# Altium schematic sheet Main2.SchDoc
size A4
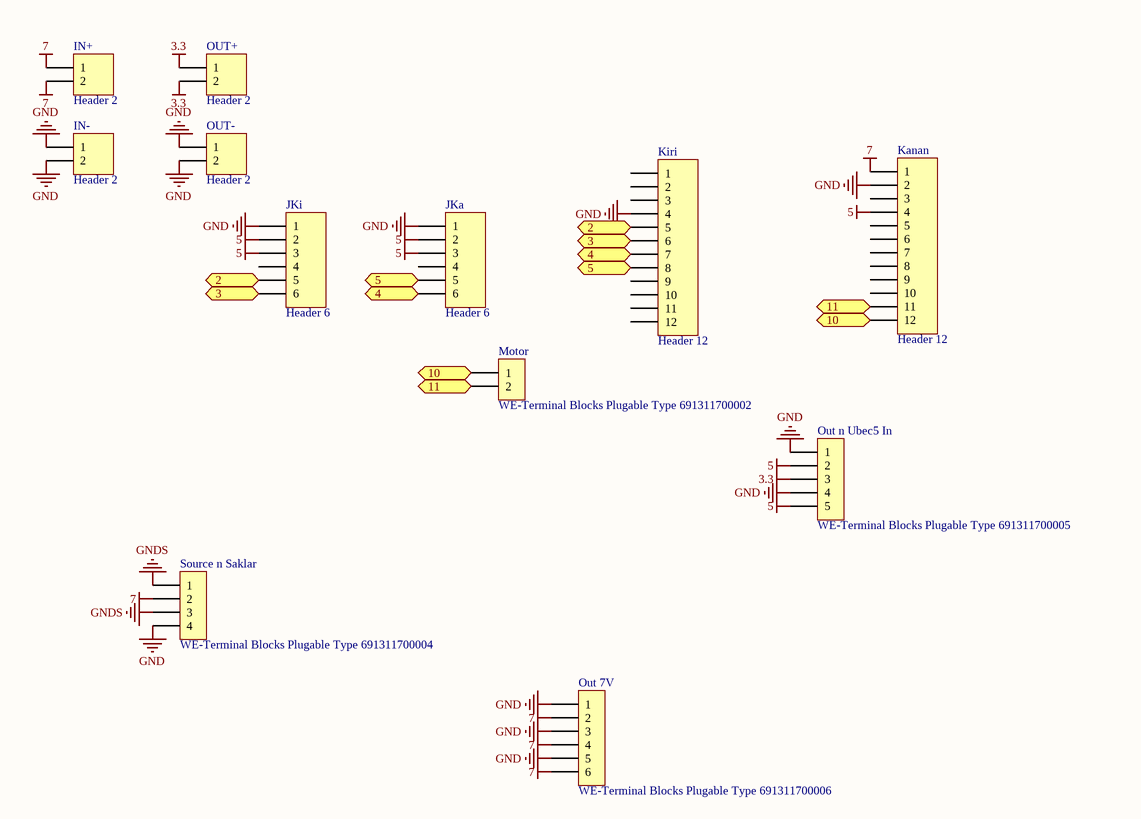
[diagram p0: Main2.SchDoc]

## Parts
IN+  Header 2  [HDR1X2]
IN-  Header 2  [HDR1X2]
JKa  Header 6  [HDR1X6]
JKi  Header 6  [HDR1X6]
Kanan  Header 12  [HDR1X12]
Kiri  Header 12  [HDR1X12]
Motor  WE-Terminal Blocks Plugable Type 691311700002  [691311700002]
OUT+  Header 2  [HDR1X2]
OUT-  Header 2  [HDR1X2]
Out_7V  WE-Terminal Blocks Plugable Type 691311700006  [691311700006]
Out_n_Ubec5_In  WE-Terminal Blocks Plugable Type 691311700005  [691311700005]
Source_n_Saklar  WE-Terminal Blocks Plugable Type 691311700004  [691311700004]

## Ports
2, 3, 4, 5, 10, 11

## Nets
3.3: OUT+.1 OUT+.2 Out_n_Ubec5_In.3
5: JKa.2 JKa.3 JKi.2 JKi.3 Kanan.4 Out_n_Ubec5_In.2 Out_n_Ubec5_In.5
7: IN+.1 IN+.2 Kanan.1 Out_7V.2 Out_7V.4 Out_7V.6 Source_n_Saklar.2
GND: IN-.1 IN-.2 JKa.1 JKi.1 Kanan.2 Kiri.4 OUT-.1 OUT-.2 Out_7V.1 Out_7V.3 Out_7V.5 Out_n_Ubec5_In.1 Out_n_Ubec5_In.4 Source_n_Saklar.4
GNDS: Source_n_Saklar.1 Source_n_Saklar.3
2: JKi.5 Kiri.5 ; port 2
3: JKi.6 Kiri.6 ; port 3
4: JKa.6 Kiri.7 ; port 4
5: JKa.5 Kiri.8 ; port 5  [a separate net that carries the same name]
10: Kanan.12 Motor.1 ; port 10
11: Kanan.11 Motor.2 ; port 11

Not connected (* = marked no-connect by the designer): JKa 4; JKi 4; Kanan 3 5 6 7 8 9 10; Kiri 1 2 3 9 10 11 12

## Library data of the parts
IN+ IN- OUT+ OUT- = Header 2: Header, 2-Pin; LatestRevisionDate: 17-Jul-2002; LatestRevisionNote: Re-released for DXP Platform.; Publisher: Altium Limited
JKa JKi = Header 6: Header, 6-Pin; LatestRevisionDate: 17-Jul-2002; LatestRevisionNote: Re-released for DXP Platform.; Publisher: Altium Limited
Kanan Kiri = Header 12: Header, 12-Pin; LatestRevisionDate: 17-Jul-2002; LatestRevisionNote: Re-released for DXP Platform.; Publisher: Altium Limited
Motor = WE-Terminal Blocks Plugable Type 691311700002: WR-TBL Terminal block - serie 3117 - 5.00mm; Manufacturer: W¨¹rth Elektronik eiSos GmbH; ComponentLink1 Description: Manufacturer; ComponentLink2 Description: Datasheet; NoPins: 02; Created Date: 6 January 2014; partNo: 691311700002; ComponentLink1URL: http://www.we-online.com; ComponentLink2URL: http://katalog.we-online.de/em/datasheet/6913117000xx.pdf; Created by: Karrer Zheng
Out_7V = WE-Terminal Blocks Plugable Type 691311700006: WR-TBL Terminal block - serie 3117 - 5.00mm; Manufacturer: W¨¹rth Elektronik eiSos GmbH; ComponentLink1 Description: Manufacturer; ComponentLink2 Description: Datasheet; NoPins: 06; Created Date: 6 January 2014; partNo: 691311700006; ComponentLink1URL: http://www.we-online.com; ComponentLink2URL: http://katalog.we-online.de/em/datasheet/6913117000xx.pdf; Created by: Karrer Zheng
Out_n_Ubec5_In = WE-Terminal Blocks Plugable Type 691311700005: WR-TBL Terminal block - serie 3117 - 5.00mm; Manufacturer: W¨¹rth Elektronik eiSos GmbH; ComponentLink1 Description: Manufacturer; ComponentLink2 Description: Datasheet; NoPins: 05; Created Date: 6 January 2014; partNo: 691311700005; ComponentLink1URL: http://www.we-online.com; ComponentLink2URL: http://katalog.we-online.de/em/datasheet/6913117000xx.pdf; Created by: Karrer Zheng
Source_n_Saklar = WE-Terminal Blocks Plugable Type 691311700004: WR-TBL Terminal block - serie 3117 - 5.00mm; Manufacturer: W¨¹rth Elektronik eiSos GmbH; ComponentLink1 Description: Manufacturer; ComponentLink2 Description: Datasheet; NoPins: 04; Created Date: 6 January 2014; partNo: 691311700004; ComponentLink1URL: http://www.we-online.com; ComponentLink2URL: http://katalog.we-online.de/em/datasheet/6913117000xx.pdf; Created by: Karrer Zheng